# Altium schematic sheet ISO_IO.SchDoc
size A3 portrait; SheetNumber: 3; SheetTotal: 8
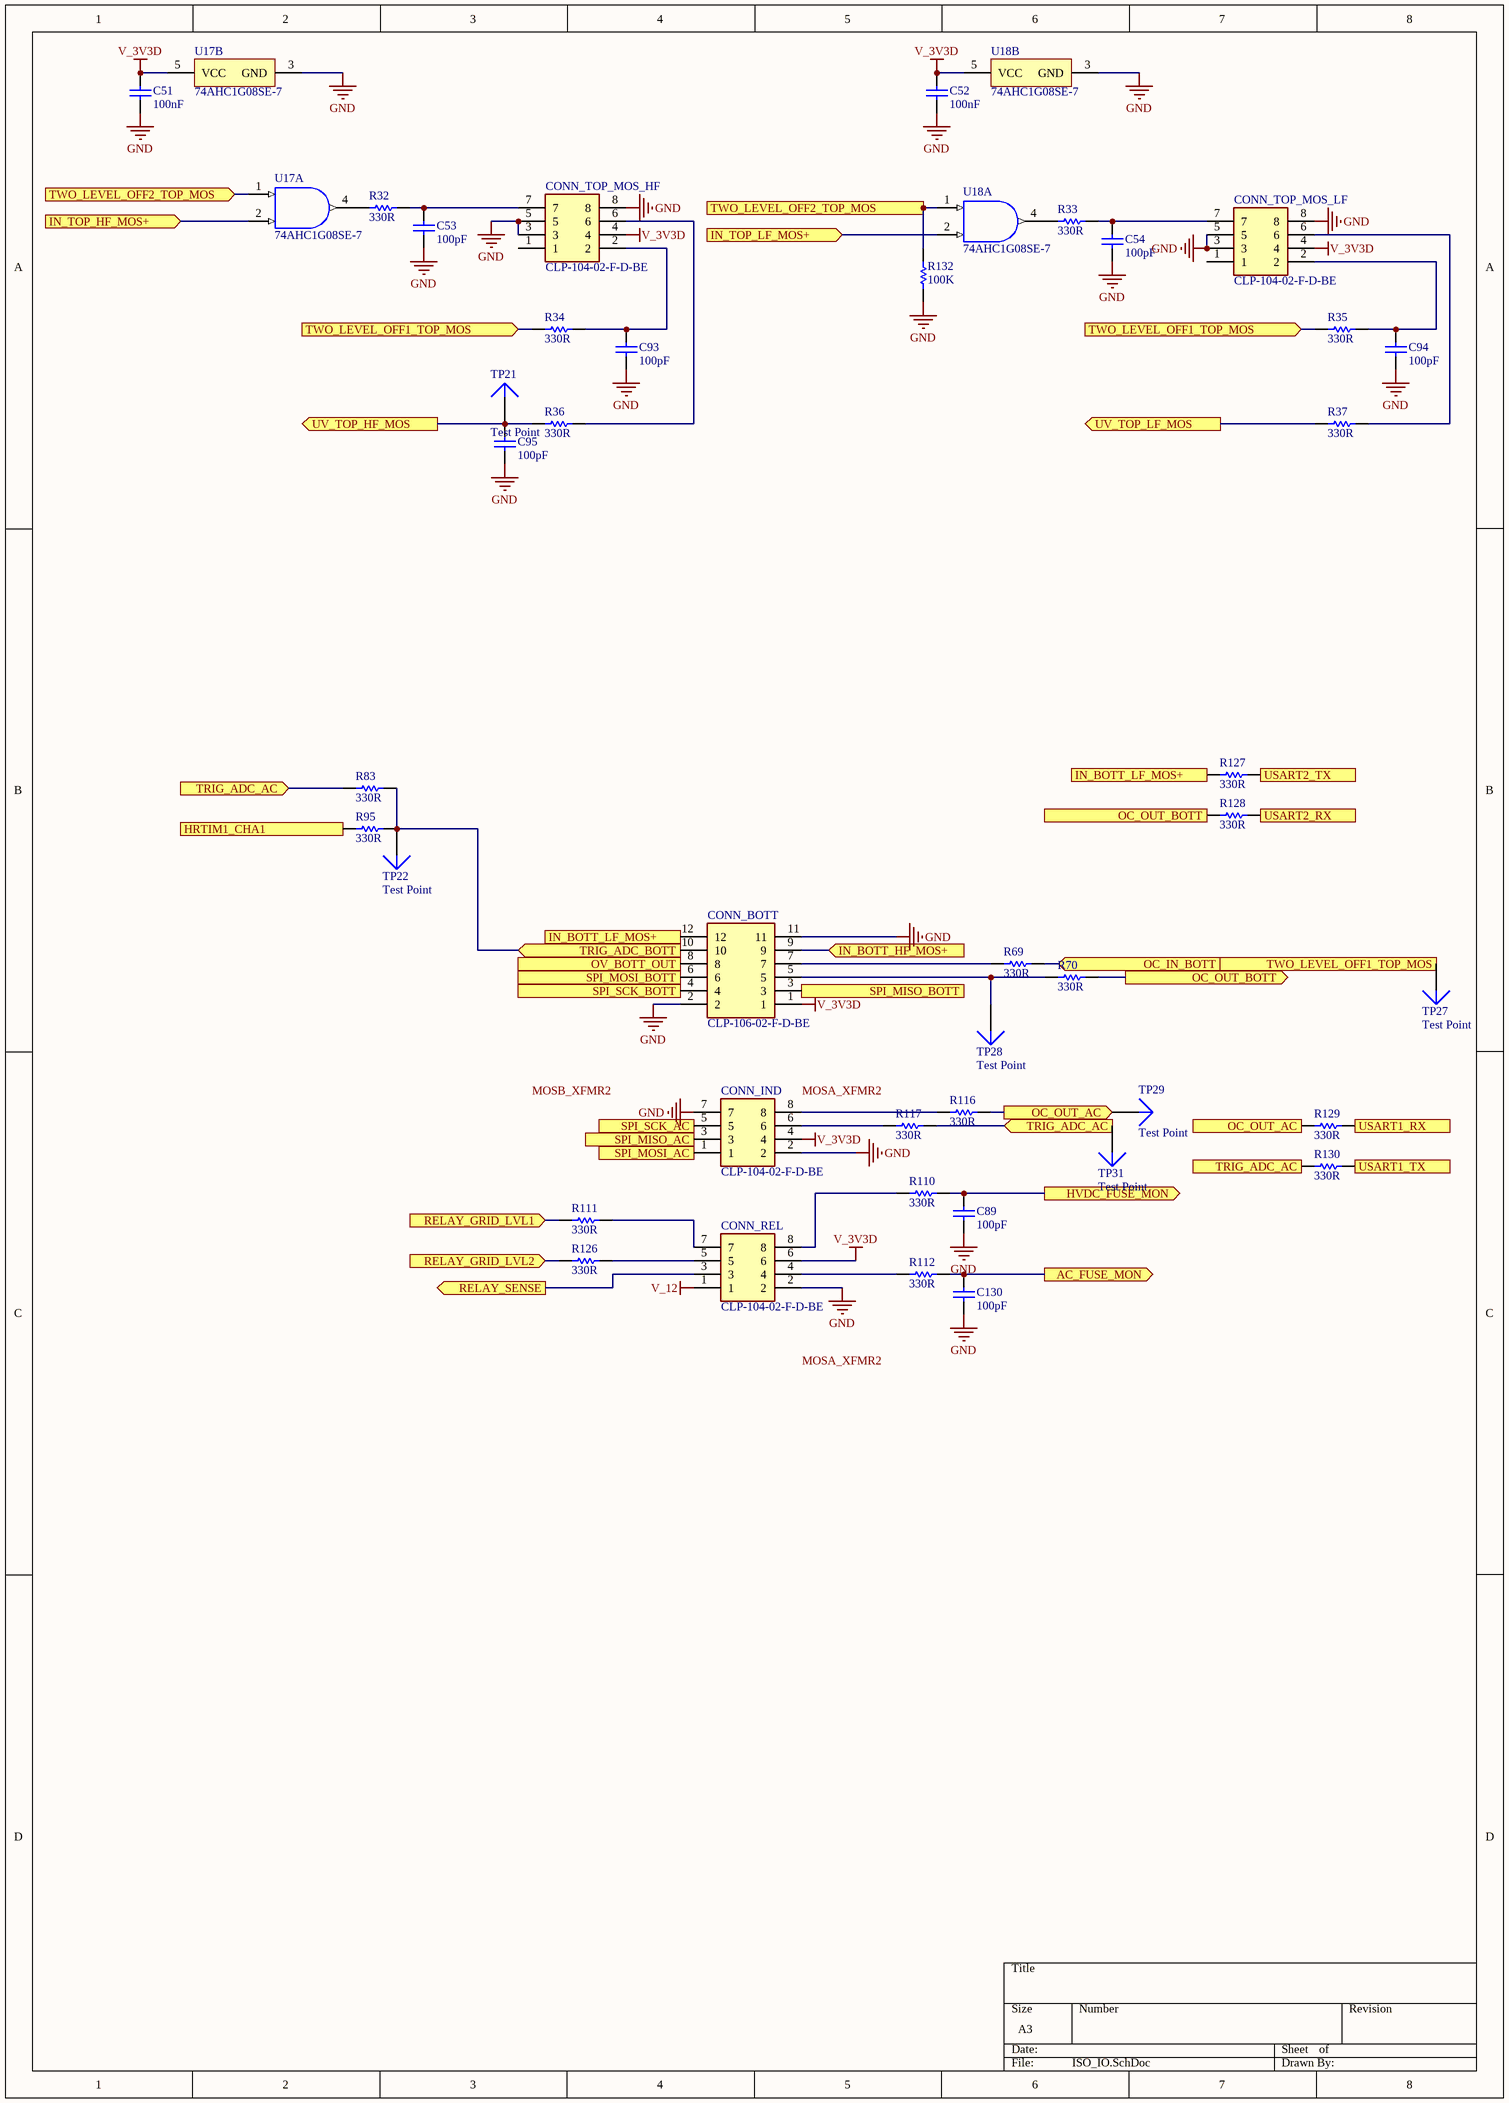
[diagram p0: ISO_IO.SchDoc]

## Parts
C51  100nF  [CAPC1608X90X35NL10T15]
C52  100nF  [CAPC1608X90X35NL10T15]
C53  100pF  [CAPC1608X90X35NL10T15]
C54  100pF  [CAPC1608X90X35NL10T15]
C89  100pF  [CAPC1608X90X35NL10T15]
C93  100pF  [CAPC1608X90X35NL10T15]
C94  100pF  [CAPC1608X90X35NL10T15]
C95  100pF  [CAPC1608X90X35NL10T15]
C130  100pF  [CAPC1608X90X35NL10T15]
CONN_BOTT  CLP-106-02-F-D-BE  [CLP-106-02-XXX-D-BE]
CONN_IND  CLP-104-02-F-D-BE  [CLP-104-02-XXX-D-BE]
CONN_REL  CLP-104-02-F-D-BE  [CLP-104-02-XXX-D-BE]
CONN_TOP_MOS_HF  CLP-104-02-F-D-BE  [CLP-104-02-XXX-D-BE]
CONN_TOP_MOS_LF  CLP-104-02-F-D-BE  [CLP-104-02-XXX-D-BE]
R32  330R  [RESC1608X55X25NL10T15]
R33  330R  [RESC1608X55X25NL10T15]
R34  330R  [RESC1608X55X25NL10T15]
R35  330R  [RESC1608X55X25NL10T15]
R36  330R  [RESC1608X55X25NL10T15]
R37  330R  [RESC1608X55X25NL10T15]
R69  330R  [RESC1608X55X25NL10T15]
R70  330R  [RESC1608X55X25NL10T15]
R83  330R  [RESC1608X55X25NL10T15]
R95  330R  [RESC1608X55X25NL10T15]
R110  330R  [RESC1608X55X25NL10T15]
R111  330R  [RESC1608X55X25NL10T15]
R112  330R  [RESC1608X55X25NL10T15]
R116  330R  [RESC1608X55X25NL10T15]
R117  330R  [RESC1608X55X25NL10T15]
R126  330R  [RESC1608X55X25NL10T15]
R127  330R  [RESC1608X55X25NL10T15]
R128  330R  [RESC1608X55X25NL10T15]
R129  330R  [RESC1608X55X25NL10T15]
R130  330R  [RESC1608X55X25NL10T15]
R132  100K  [RESC1608X55X25NL10T15]
TP21  Test Point  [TP1.5mm]
TP22  Test Point  [TP1.5mm]
TP27  Test Point  [TP1.5mm]
TP28  Test Point  [TP1.5mm]
TP29  Test Point  [TP1.5mm]
TP31  Test Point  [TP1.5mm]
U17  74AHC1G08SE-7  [DCK0005A_M]  (parts A,B of 2)
U18  74AHC1G08SE-7  [DCK0005A_M]  (parts A,B of 2)

## Ports
AC_FUSE_MON (out), HRTIM1_CHA1 (in), HVDC_FUSE_MON (out), IN_BOTT_HF_MOS+ (in), IN_BOTT_LF_MOS+ (in), IN_BOTT_LF_MOS+ (out), IN_TOP_HF_MOS+ (in), IN_TOP_LF_MOS+ (in), OC_IN_BOTT (in), OC_OUT_AC (in), OC_OUT_AC (out), OC_OUT_BOTT (in), OC_OUT_BOTT (out), OV_BOTT_OUT (out), RELAY_GRID_LVL1 (in), RELAY_GRID_LVL2 (in), RELAY_SENSE (out), SPI_MISO_AC (in), SPI_MISO_BOTT (in), SPI_MOSI_AC (out), SPI_MOSI_BOTT (out), SPI_SCK_AC (out), SPI_SCK_BOTT (out), TRIG_ADC_AC (in), TRIG_ADC_AC (out), TRIG_ADC_BOTT (in), TWO_LEVEL_OFF1_TOP_MOS (in), TWO_LEVEL_OFF1_TOP_MOS (out), TWO_LEVEL_OFF2_TOP_MOS (in), USART1_RX (out), USART1_TX (in), USART2_RX (out), USART2_TX (in), UV_TOP_HF_MOS (out), UV_TOP_LF_MOS (out)

## Nets
GND: C51.1 C52.1 C53.1 C54.1 C89.1 C93.1 C94.1 C95.1 C130.1 CONN_BOTT.2 CONN_BOTT.11 CONN_IND.2 CONN_IND.7 CONN_REL.2 CONN_TOP_MOS_HF.3 CONN_TOP_MOS_HF.5 CONN_TOP_MOS_HF.8 CONN_TOP_MOS_LF.3 CONN_TOP_MOS_LF.5 CONN_TOP_MOS_LF.8 R132.1 U17.3(GND) U18.3(GND)
V_3V3D: C51.2 C52.2 CONN_BOTT.1 CONN_IND.4 CONN_REL.6 CONN_TOP_MOS_HF.4 CONN_TOP_MOS_LF.4 U17.5(VCC) U18.5(VCC)
V_12: CONN_REL.1
AC_FUSE_MON: C130.2 R112.1 ; port AC_FUSE_MON
HRTIM1_CHA1: R95.1 ; port HRTIM1_CHA1
HVDC_FUSE_MON: C89.2 R110.1 ; port HVDC_FUSE_MON
IN_BOTT_HF_MOS+: CONN_BOTT.9 ; port IN_BOTT_HF_MOS+
IN_BOTT_LF_MOS+: CONN_BOTT.12 R127.1 ; port IN_BOTT_LF_MOS+
IN_TOP_HF_MOS+: U17.2(B) ; port IN_TOP_HF_MOS+
IN_TOP_LF_MOS+: U18.2(B) ; port IN_TOP_LF_MOS+
OC_IN_BOTT: R34.1 R35.1 R69.2 TP27.1 ; port TWO_LEVEL_OFF1_TOP_MOS, port OC_IN_BOTT
OC_OUT_AC: R116.2 R129.1 TP29.1 ; port OC_OUT_AC
OC_OUT_BOTT: R70.2 R128.1 ; port OC_OUT_BOTT
OV_BOTT_OUT: CONN_BOTT.8 ; port OV_BOTT_OUT
RELAY_GRID_LVL1: R111.2 ; port RELAY_GRID_LVL1
RELAY_GRID_LVL2: R126.1 ; port RELAY_GRID_LVL2
RELAY_SENSE: CONN_REL.3 ; port RELAY_SENSE
SPI_MISO_AC: CONN_IND.3 ; port SPI_MISO_AC
SPI_MISO_BOTT: CONN_BOTT.3 ; port SPI_MISO_BOTT
SPI_MOSI_AC: CONN_IND.1 ; port SPI_MOSI_AC
SPI_MOSI_BOTT: CONN_BOTT.6 ; port SPI_MOSI_BOTT
SPI_SCK_AC: CONN_IND.5 ; port SPI_SCK_AC
SPI_SCK_BOTT: CONN_BOTT.4 ; port SPI_SCK_BOTT
TRIG_ADC_AC: R83.1 R117.2 R130.1 TP31.1 ; port TRIG_ADC_AC
TRIG_ADC_BOTT: CONN_BOTT.10 R83.2 R95.2 TP22.1 ; port TRIG_ADC_BOTT
TWO_LEVEL_OFF2_TOP_MOS: R132.2 U17.1(A) U18.1(A) ; port TWO_LEVEL_OFF2_TOP_MOS
USART1_RX: R129.2 ; port USART1_RX
USART1_TX: R130.2 ; port USART1_TX
USART2_RX: R128.2 ; port USART2_RX
USART2_TX: R127.2 ; port USART2_TX
UV_TOP_HF_MOS: C95.2 R36.1 TP21.1 ; port UV_TOP_HF_MOS
UV_TOP_LF_MOS: R37.1 ; port UV_TOP_LF_MOS
NetC53_2: C53.2 CONN_TOP_MOS_HF.7 R32.2
NetC54_2: C54.2 CONN_TOP_MOS_LF.7 R33.2
NetC93_2: C93.2 CONN_TOP_MOS_HF.2 R34.2
NetC94_2: C94.2 CONN_TOP_MOS_LF.2 R35.2
NetCONN_BOTT_5: CONN_BOTT.5 R70.1 TP28.1
NetCONN_BOTT_7: CONN_BOTT.7 R69.1
NetCONN_IND_6: CONN_IND.6 R117.1
NetCONN_IND_8: CONN_IND.8 R116.1
NetCONN_REL_4: CONN_REL.4 R112.2
NetCONN_REL_5: CONN_REL.5 R126.2
NetCONN_REL_7: CONN_REL.7 R111.1
NetCONN_REL_8: CONN_REL.8 R110.2
NetCONN_TOP_MOS_HF_6: CONN_TOP_MOS_HF.6 R36.2
NetCONN_TOP_MOS_LF_6: CONN_TOP_MOS_LF.6 R37.2
NetR32_1: R32.1 U17.4(Y)
NetR33_1: R33.1 U18.4(Y)

Not connected (* = marked no-connect by the designer): CONN_TOP_MOS_HF 1; CONN_TOP_MOS_LF 1

## Notes on the sheet
- Labels drawn without touching a wire or pin: MOSA_XFMR2, MOSB_XFMR2

## Library data of the parts
C51 C52 = CAP: X7R 100nF ±10% 50V 0603 Multilayer Ceramic Capacitors MLCC - SMD/SMT ROHS; Part Number: GCM188R72A104KA64D; Manufacturer: Murata; Manufacturer Part Number: CC0603KRX7R9BB104; Voltage Rating: 100V; Supplier 1: Arrow Electronics; Supplier Part Number 1: GCM188R72A104KA64D; RoHS: Yes; Category: Ceramic Capacitors; Mount: Surface Mount; Case/Package: 0603; Case Code (Imperial): 0603; Case Code (Metric): 1608; Min Operating Temperature: -55°C; Max Operating Temperature: 125°C; Tolerance: 10%; Packaging: Tape and Reel; Capacitance: 100nF; Dielectric: X7R; Termination: SMD/SMT; Voltage Rating (DC): 100V; Length: 1.6mm; Height: 0.8mm; Depth: 0.8mm; Radiation Hardening: No; ComponentLink1URL: https://datasheet.ciiva.com/17451/product-17451047.pdf?src-supplier=Avnet+Europe; ComponentLink1Description: https://datasheet.ciiva.com/17451/product-17451047.pdf?src-supplier=Avnet+Europe; ComponentLink2URL: https://datasheet.ciiva.com/26889/getdatasheetpartid-387765-26889164.pdf?src-supplier=Verical; ComponentLink2Description: https://datasheet.ciiva.com/26889/getdatasheetpartid-387765-26889164.pdf?src-supplier=Verical; Parameter 1: *; JLCPCB Part #: C14663
C53 C54 C89 C93-C95 C130 = CMP-2006-02595-1: C0G ±5% 50V 100pF 0603 Multilayer Ceramic Capacitors MLCC - SMD/SMT ROHS; Part Number: GRM1885C1H101JA01D; Manufacturer: Murata; Temperature Coefficient: 30ppm/°C; Insulation Resistance: 10GR; Supplier 1: Digi-Key; Supplier Part Number 1: 490-1427-1-ND; Manufacturer Part Number: GRM1885C1H101JA01D; RoHS: Yes; Category: Ceramic Capacitors; Stock 1: 98306; Pricing 1: 1=0.10000, 10=0.06100, 50=0.03320, 100=0.02700, 500=0.01932, 1000=0.01518 (USD); Mount: Surface Mount; Case/Package: 0603; Number of Pins: 2; Case Code (Metric): 1608; Case Code (Imperial): 0603; Dielectric Material: Ceramic; Weight: 7.1E-05oz; Material: Ceramic; Min Operating Temperature: -55°C; Max Operating Temperature: 125°C; Capacitance: 100pF; Voltage Rating: 50V; Tolerance: 5%; Packaging: Tape and Reel; Package Quantity: 1; Voltage Rating (DC): 50V; Dielectric: C0G; Termination: SMD/SMT; Voltage: 50V; Length: 1.6mm; Width: 0.031inch; Height: 0.8mm; Thickness: 0.035inch; Depth: 0.8mm; Radiation Hardening: No; RoHS Compliant: Yes; REACH SVHC: Unknown; Lead Free: Lead Free; ComponentLink1URL: https://datasheet.ciiva.com/131/product-131088.pdf?src-supplier=Digi-Key; ComponentLink1Description: https://datasheet.ciiva.com/131/product-131088.pdf?src-supplier=Digi-Key; ComponentLink2URL: https://datasheet.ciiva.com/18100/getdatasheetpartid-26823-18100641.pdf?src-supplier=Verical; ComponentLink2Description: https://datasheet.ciiva.com/18100/getdatasheetpartid-26823-18100641.pdf?src-supplier=Verical; ComponentLink3URL: https://datasheet.ciiva.com/3777/grm1885c1h101ja0123-3777264.pdf?src-supplier=Arrow+Electronics; ComponentLink3Description: https://datasheet.ciiva.com/3777/grm1885c1h101ja0123-3777264.pdf?src-supplier=Arrow+Electronics; ComponentLink4URL: https://datasheet.ciiva.com/29149/450134-da-01-en-vs-kondensator-0603-29149008.pdf?src-supplier=Conrad; ComponentLink4Description: https://datasheet.ciiva.com/29149/450134-da-01-en-vs-kondensator-0603-29149008.pdf?src-supplier=Conrad; ComponentLink5URL: https://datasheet.ciiva.com/131/partnumbering-e-01-131089.pdf?src-supplier=Digi-Key; ComponentLink5Description: https://datasheet.ciiva.com/131/partnumbering-e-01-131089.pdf?src-supplier=Digi-Key; ComponentLink6URL: https://datasheet.ciiva.com/11605/c02e-11605557.pdf?src-supplier=Avnet; ComponentLink6Description: https://datasheet.ciiva.com/11605/c02e-11605557.pdf?src-supplier=Avnet; ComponentLink7URL: https://datasheet.ciiva.com/28556/4360-28556551.pdf?src-supplier=Element14; ComponentLink7Description: https://datasheet.ciiva.com/28556/4360-28556551.pdf?src-supplier=Element14; ComponentLink8URL: https://datasheet.ciiva.com/7828/4360-7828889.pdf?src-supplier=Element14; ComponentLink8Description: https://datasheet.ciiva.com/7828/4360-7828889.pdf?src-supplier=Element14; ComponentLink9URL: https://datasheet.ciiva.com/7828/4360-7828890.pdf?src-supplier=Element14; ComponentLink9Description: https://datasheet.ciiva.com/7828/4360-7828890.pdf?src-supplier=Element14; ComponentLink10URL: https://datasheet.ciiva.com/7828/4360-7828891.pdf?src-supplier=Element14; ComponentLink10Description: https://datasheet.ciiva.com/7828/4360-7828891.pdf?src-supplier=Element14; ComponentLink11URL: https://datasheet.ciiva.com/14116/grmseries-tc-hitype-eng-14116828.pdf?src-supplier=Distrelec; ComponentLink11Description: https://datasheet.ciiva.com/14116/grmseries-tc-hitype-eng-14116828.pdf?src-supplier=Distrelec; ComponentLink12URL: https://datasheet.ciiva.com/16291/product-16291613.pdf?src-supplier=Future+Electronics; ComponentLink12Description: https://datasheet.ciiva.com/16291/product-16291613.pdf?src-supplier=Future+Electronics; ComponentLink13URL: https://datasheet.ciiva.com/131/partnumbering-e-01-131087.pdf?src-supplier=Digi-Key; ComponentLink13Description: https://datasheet.ciiva.com/131/partnumbering-e-01-131087.pdf?src-supplier=Digi-Key; ComponentLink14URL: https://datasheet.ciiva.com/14116/grmseries-tc-hitype-eng-14116815.pdf?src-supplier=Distrelec; ComponentLink14Description: https://datasheet.ciiva.com/14116/grmseries-tc-hitype-eng-14116815.pdf?src-supplier=Distrelec; Parameter 1: *; JLCPCB Part #: C14858
CONN_BOTT = CLP-106-02-F-D-BE: Connector; Manufacturer_Name: SAMTEC; Datasheet Link: http://suddendocs.samtec.com/prints/erm8-xxx-xx.x-xxx-dv-xxxx-xx-mkt.pdf; Manufacturer_Part_Number: CLP-106-02-F-D-BE; Mouser Part Number: 200-CLP10602FDBE; Mouser Price/Stock: https://www.mouser.co.uk/ProductDetail/Samtec/CLP-106-02-F-D-BE?qs=0lQeLiL1qybMRsXYGL6Lww%3D%3D; Arrow Part Number: CLP-106-02-F-D-BE; Arrow Price/Stock: https://www.arrow.com/en/products/clp-106-02-f-d-be/samtec; Parameter 1: *; JLCPCB Part #: *
CONN_IND CONN_REL CONN_TOP_MOS_HF CONN_TOP_MOS_LF = CLP-104-02-F-D-BE: Connector; Manufacturer_Name: SAMTEC; Datasheet Link: http://suddendocs.samtec.com/prints/erm8-xxx-xx.x-xxx-dv-xxxx-xx-mkt.pdf; Manufacturer_Part_Number: CLP-104-02-F-D-BE; Mouser Part Number: 200-CLP10402FDBE; Mouser Price/Stock: https://www.mouser.co.uk/ProductDetail/Samtec/CLP-104-02-F-D-BE?qs=0lQeLiL1qybJIh6Z%2F3PMbA%3D%3D; Arrow Part Number: CLP-104-02-F-D-BE; Arrow Price/Stock: https://www.arrow.com/en/products/clp-104-02-f-d-be/samtec; Parameter 1: *; JLCPCB Part #: *
R32-R37 = RES-2: ±1% 330Ω ±100ppm/℃ 0.1W 0603 Chip Resistor - Surface Mount ROHS; Tolerance: 10%; ESR: 800 mohm; Voltage Rating (DC): 16 V; Capacitance: 47 uF; Length: 7.3 mm; ComponentLink1URL: http://www.yageo.com/; Packaging: Tape and Reel; Pins: 2; ComponentLink1Description: Manufacturer URL; Case Code (Imperial): 2917; REACH SVHC: No SVHC; Width: 4.3 mm; ComponentLink2Description: Datasheet; Voltage Rating: 16 V; RoHSCompliant: True; Max Operating Temperature: 125degC; ComponentLink2URL: http://www.yageo.com/documents/recent/PYu-RC_Group_51_RoHS_L_04.pdf; Min Operating Temperature: -55degC; Case/Package: 2917; Radiation Hardening: No; DatasheetVersion: Rev. 4, 02/2016; Mount: Surface Mount; PackageReference: 0603; Package Quantity: 500; Case Code (Metric): 7343; PackageDescription: 2-Pin Surface Mount Device, Body 1.6 x 0.8 mm; Height: 3.1 mm; Parameter 1: *; JLCPCB Part #: C23138
R69 R70 R83 R95 R116 R117 R126-R130 = CMP-1659-00020-2: ±1% 330Ω ±100ppm/℃ 0.1W 0603 Chip Resistor - Surface Mount ROHS; Manufacturer: Yageo; Manufacturer Part Number: RC0603FR-07330RL; Tolerance: 10%; ESR: 800 mohm; Voltage Rating (DC): 16 V; Capacitance: 47 uF; Temperature Coefficient: 100ppm/°C; Power Rating: 100mW; Length: 7.3 mm; ComponentLink1URL: http://www.yageo.com/; Packaging: Tape and Reel; Pins: 2; ComponentLink1Description: Manufacturer URL; Case Code (Imperial): 2917; REACH SVHC: No SVHC; Width: 4.3 mm; ComponentLink2Description: Datasheet; Voltage Rating: 16 V; RoHSCompliant: True; Max Operating Temperature: 125degC; ComponentLink2URL: http://www.yageo.com/documents/recent/PYu-RC_Group_51_RoHS_L_04.pdf; Min Operating Temperature: -55degC; Case/Package: 2917; Radiation Hardening: No; DatasheetVersion: Rev. 4, 02/2016; Mount: Surface Mount; PackageReference: 0603; Package Quantity: 500; Case Code (Metric): 7343; PackageDescription: 2-Pin Surface Mount Device, Body 1.6 x 0.8 mm; Height: 3.1 mm; Supplier 1: Digi-Key; Supplier Part Number 1: 311-330HRCT-ND; RoHS: Yes; Category: Chip SMD Resistors; Stock 1: 4209654; Pricing 1: 1=0.10000, 10=0.02300, 100=0.00940, 1000=0.00421, 2500=0.00366 (USD); Number of Pins: 2; Composition: Thick Film; Resistance: 330R; Number of Terminations: 2; Max Power Dissipation: 100mW; Termination: SMD/SMT; Features: Moisture Resistant; Depth: 0.8mm; Lead Free: Lead Free; ComponentLink3URL: https://datasheet.ciiva.com/11819/0900766b80f96399-11819327.pdf?src-supplier=RSComponents; ComponentLink3Description: https://datasheet.ciiva.com/11819/0900766b80f96399-11819327.pdf?src-supplier=RSComponents; ComponentLink4URL: https://datasheet.ciiva.com/2454/pyu-r-int-thick-7-2454864.pdf?src-supplier=Digi-Key; ComponentLink4Description: https://datasheet.ciiva.com/2454/pyu-r-int-thick-7-2454864.pdf?src-supplier=Digi-Key; ComponentLink5URL: https://datasheet.ciiva.com/2454/pyu-r-int-thick-7-2454865.pdf?src-supplier=Digi-Key; ComponentLink5Description: https://datasheet.ciiva.com/2454/pyu-r-int-thick-7-2454865.pdf?src-supplier=Digi-Key; ComponentLink6URL: https://datasheet.ciiva.com/2454/pyu-r-int-thick-7-2454866.pdf?src-supplier=Digi-Key; ComponentLink6Description: https://datasheet.ciiva.com/2454/pyu-r-int-thick-7-2454866.pdf?src-supplier=Digi-Key; ComponentLink7URL: https://datasheet.ciiva.com/12555/rc0603-272842-12555334.pdf?src-supplier=Mouser; ComponentLink7Description: https://datasheet.ciiva.com/12555/rc0603-272842-12555334.pdf?src-supplier=Mouser; ComponentLink8URL: https://datasheet.ciiva.com/46440/1868787-46440904.pdf?src-supplier=Element14; ComponentLink8Description: https://datasheet.ciiva.com/46440/1868787-46440904.pdf?src-supplier=Element14; ComponentLink9URL: https://datasheet.ciiva.com/7746/443971-7746329.pdf?src-supplier=Element14; ComponentLink9Description: https://datasheet.ciiva.com/7746/443971-7746329.pdf?src-supplier=Element14; ComponentLink10URL: https://datasheet.ciiva.com/7746/443971-7746330.pdf?src-supplier=Element14; ComponentLink10Description: https://datasheet.ciiva.com/7746/443971-7746330.pdf?src-supplier=Element14; ComponentLink11URL: https://datasheet.ciiva.com/7746/1686128-7746331.pdf?src-supplier=Element14; ComponentLink11Description: https://datasheet.ciiva.com/7746/1686128-7746331.pdf?src-supplier=Element14; Parameter 1: *; JLCPCB Part #: C23138
R110-R112 = RES-2: ±1% 330Ω ±100ppm/℃ 0.1W 0603 Chip Resistor - Surface Mount ROHS; Manufacturer: Yageo; Manufacturer Part Number: RC0603FR-07330RL; Tolerance: 10%; ESR: 800 mohm; Voltage Rating (DC): 16 V; Capacitance: 47 uF; Temperature Coefficient: 100ppm/°C; Power Rating: 100mW; Length: 7.3 mm; ComponentLink1URL: http://www.yageo.com/; Packaging: Tape and Reel; Pins: 2; ComponentLink1Description: Manufacturer URL; Case Code (Imperial): 2917; REACH SVHC: No SVHC; Width: 4.3 mm; ComponentLink2Description: Datasheet; Voltage Rating: 16 V; RoHSCompliant: True; Max Operating Temperature: 125degC; ComponentLink2URL: http://www.yageo.com/documents/recent/PYu-RC_Group_51_RoHS_L_04.pdf; Min Operating Temperature: -55degC; Case/Package: 2917; Radiation Hardening: No; DatasheetVersion: Rev. 4, 02/2016; Mount: Surface Mount; PackageReference: 0603; Package Quantity: 500; Case Code (Metric): 7343; PackageDescription: 2-Pin Surface Mount Device, Body 1.6 x 0.8 mm; Height: 3.1 mm; Supplier 1: Digi-Key; Supplier Part Number 1: 311-330HRCT-ND; RoHS: Yes; Category: Chip SMD Resistors; Stock 1: 4209654; Pricing 1: 1=0.10000, 10=0.02300, 100=0.00940, 1000=0.00421, 2500=0.00366 (USD); Number of Pins: 2; Composition: Thick Film; Resistance: 330R; Number of Terminations: 2; Max Power Dissipation: 100mW; Termination: SMD/SMT; Features: Moisture Resistant; Depth: 0.8mm; Lead Free: Lead Free; ComponentLink3URL: https://datasheet.ciiva.com/11819/0900766b80f96399-11819327.pdf?src-supplier=RSComponents; ComponentLink3Description: https://datasheet.ciiva.com/11819/0900766b80f96399-11819327.pdf?src-supplier=RSComponents; ComponentLink4URL: https://datasheet.ciiva.com/2454/pyu-r-int-thick-7-2454864.pdf?src-supplier=Digi-Key; ComponentLink4Description: https://datasheet.ciiva.com/2454/pyu-r-int-thick-7-2454864.pdf?src-supplier=Digi-Key; ComponentLink5URL: https://datasheet.ciiva.com/2454/pyu-r-int-thick-7-2454865.pdf?src-supplier=Digi-Key; ComponentLink5Description: https://datasheet.ciiva.com/2454/pyu-r-int-thick-7-2454865.pdf?src-supplier=Digi-Key; ComponentLink6URL: https://datasheet.ciiva.com/2454/pyu-r-int-thick-7-2454866.pdf?src-supplier=Digi-Key; ComponentLink6Description: https://datasheet.ciiva.com/2454/pyu-r-int-thick-7-2454866.pdf?src-supplier=Digi-Key; ComponentLink7URL: https://datasheet.ciiva.com/12555/rc0603-272842-12555334.pdf?src-supplier=Mouser; ComponentLink7Description: https://datasheet.ciiva.com/12555/rc0603-272842-12555334.pdf?src-supplier=Mouser; ComponentLink8URL: https://datasheet.ciiva.com/46440/1868787-46440904.pdf?src-supplier=Element14; ComponentLink8Description: https://datasheet.ciiva.com/46440/1868787-46440904.pdf?src-supplier=Element14; ComponentLink9URL: https://datasheet.ciiva.com/7746/443971-7746329.pdf?src-supplier=Element14; ComponentLink9Description: https://datasheet.ciiva.com/7746/443971-7746329.pdf?src-supplier=Element14; ComponentLink10URL: https://datasheet.ciiva.com/7746/443971-7746330.pdf?src-supplier=Element14; ComponentLink10Description: https://datasheet.ciiva.com/7746/443971-7746330.pdf?src-supplier=Element14; ComponentLink11URL: https://datasheet.ciiva.com/7746/1686128-7746331.pdf?src-supplier=Element14; ComponentLink11Description: https://datasheet.ciiva.com/7746/1686128-7746331.pdf?src-supplier=Element14; Parameter 1: *; JLCPCB Part #: C23138
R132 = CMP-2100-03662-1: ±1% 100kΩ ±100ppm/℃ 0.1W 0603 Chip Resistor - Surface Mount ROHS; Manufacturer: Yageo; Manufacturer Part Number: RC0603FR-07100KL; Power Rating: 100mW; Voltage Rating: 50V; Resistance: 100KOhm; Temperature Coefficient: 100ppm/degreesC; Working Voltage: 75V; Datasheet Version: Rev. 5, 10/2016; Height: 0.45mm; Lead Free: LeadFree; Manufacturer URL: http://www.yageo.com/; Package Reference: 0603; Depth: 0.8mm; RoHSCompliant: true; Composition: ThickFilm; Military Standard: Not; Case/Package: 0603; Packaging: TapeandReel; Case Code (Imperial): 0603; Voltage Rating (DC): 50V; Case Code (Metric): 1608; Tolerance: 1%; Termination: SMD/SMT; Min Operating Temperature: -55degC; Number of Pins: 2; Length: 1.6mm; Width: 0.8mm; Datasheet URL: http://www.yageo.com/NewPortal/yageodocoutput?fileName=/pdf/R-Chip/PYu-RC_Group_51_RoHS_L_5.pdf; Package Description: 2-Pin Surface Mount Device, Body 1.6 x 0.8 mm; Max Operating Temperature: 155degC; REACH SVHC: NoSVHC; Supplier 1: Digi-Key; Supplier Part Number 1: 311-100KHRCT-ND; RoHS: Yes; Category: Chip SMD Resistors; Stock 1: 19283456; Pricing 1: 1=0.10000, 10=0.02400, 100=0.00970, 1000=0.00436, 2500=0.00378 (USD); Series: RC; Max Power Dissipation: 100mW; Resistor Type: Thick Film; Number of Terminations: 2; Resistance Tolerance: 1%; Features: Moisture Resistant; Construction: Rectangular; Technology: THICK FILM; RoHS Compliant: Yes; ComponentLink1URL: https://datasheet.ciiva.com/11808/0900766b80f96399-11808107.pdf?src-supplier=RSComponents; ComponentLink1Description: https://datasheet.ciiva.com/11808/0900766b80f96399-11808107.pdf?src-supplier=RSComponents; ComponentLink2URL: https://datasheet.ciiva.com/7983/443971-7983593.pdf?src-supplier=Element14; ComponentLink2Description: https://datasheet.ciiva.com/7983/443971-7983593.pdf?src-supplier=Element14; ComponentLink3URL: https://datasheet.ciiva.com/46440/1868787-46440889.pdf?src-supplier=Element14; ComponentLink3Description: https://datasheet.ciiva.com/46440/1868787-46440889.pdf?src-supplier=Element14; ComponentLink4URL: https://datasheet.ciiva.com/7746/1738695-7746234.pdf?src-supplier=Element14; ComponentLink4Description: https://datasheet.ciiva.com/7746/1738695-7746234.pdf?src-supplier=Element14; ComponentLink5URL: https://datasheet.ciiva.com/7746/1738695-7746235.pdf?src-supplier=Element14; ComponentLink5Description: https://datasheet.ciiva.com/7746/1738695-7746235.pdf?src-supplier=Element14; ComponentLink6URL: https://datasheet.ciiva.com/22747/443971-22747516.pdf?src-supplier=Element14; ComponentLink6Description: https://datasheet.ciiva.com/22747/443971-22747516.pdf?src-supplier=Element14; Parameter 1: *; JLCPCB Part #: C25803
TP21 TP22 TP27-TP29 TP31 = Test_Point 1.5mm round: Round Test Point; LatestRevisionDate: 17-Jul-2002; LatestRevisionNote: Re-released for DXP Platform.; Publisher: Altium Limited; Parameter 1: *; JLCPCB Part #: *
U17 U18 = CMP-0859-00394-3: Single 2-Input Positive-AND Gate, DCK0005A, SMALL T&R; Generic Part Number: SN74AHC1G08; Manufacturer: Texas Instruments; Schmitt Trigger: No; ICC @ Nom Voltage(Max)(mA): 0.01; Technology Family: AHC; Output Drive (IOL/IOH)(Max)(mA): 50/-50; tpd @ Nom Voltage(Max)(ns): 12.3,7.9; Logic: True; Gate Type: AND; VCC(Min)(V): 2; Input Type: CMOS; Voltage(Nom)(V): 3.3,5; Bits(#): 1; VCC(Max)(V): 5.5; F @ Nom Voltage(Max)(Mhz): 75; Rating: Catalog; 3-State Output: No; Operating Temperature Range(C): -55 to 125; DatasheetVersion: SCLS314N; Sub-Family: AND Gate; Output Type: CMOS; PackageReference: DCK0005A; Parameter 1: *; JLCPCB Part #: *